# Altium schematic sheet 03-PulseGenerator.SchDoc
size A4
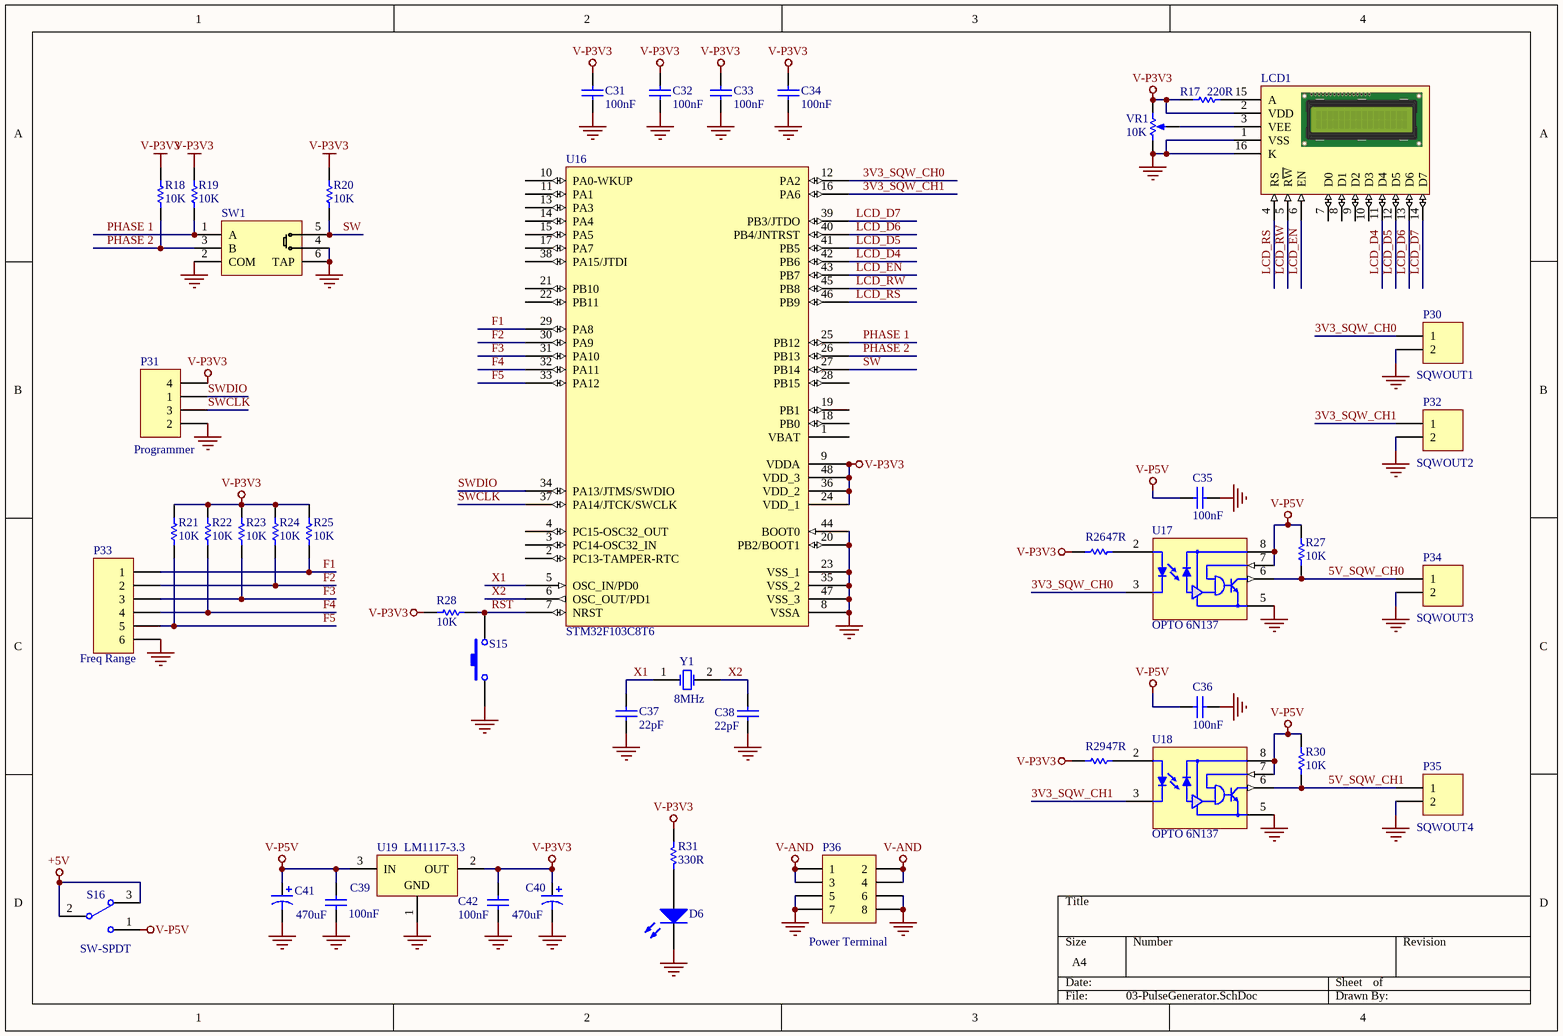
[diagram p0: 03-PulseGenerator.SchDoc]

## Parts
C31  value 100nF  [c-0805]  (hidden comment: 104)
C32  value 100nF  [c-0805]  (hidden comment: 104)
C33  value 100nF  [c-0805]  (hidden comment: 104)
C34  value 100nF  [c-0805]  (hidden comment: 104)
C35  value 100nF  [c-0805]  (hidden comment: 104)
C36  value 100nF  [c-0805]  (hidden comment: 104)
C37  value 22pF  [c-0805]  (hidden comment: 22)
C38  value 22pF  [c-0805]  (hidden comment: 22)
C39  value 100nF  [c-0805]  (hidden comment: 104)
C40  value 470uF  [C-ALU-10x10mm]  (hidden comment: 470uF/16V)
C41  value 470uF  [C-ALU-10x10mm]  (hidden comment: 470uF/16V)
C42  value 100nF  [c-0805]  (hidden comment: 104)
D6  LED  [LED-3528]  (value not drawn)
LCD1  LCD1602  [LCD-1602A]  (value not drawn)
P30  value SQWOUT1  [hed2]  (hidden comment: KF301)
P31  value Programmer  [HDR1X4]  (hidden comment: H4)
P32  value SQWOUT2  [hed2]  (hidden comment: KF301)
P33  value Freq Range  [HDR1X6]  (hidden comment: SW-5Way)
P34  value SQWOUT3  [hed2]  (hidden comment: KF301)
P35  value SQWOUT4  [hed2]  (hidden comment: KF301)
P36  Publisher: Power Terminal  [HDR2X4]  (hidden comment: Header 4X2)
R17  220R  [r-0805]
R18  value 10K  [r-0805]  (hidden comment: Res1)
R19  value 10K  [r-0805]  (hidden comment: Res1)
R20  value 10K  [r-0805]  (hidden comment: Res1)
R21  value 10K  [r-0805]  (hidden comment: Res1)
R22  value 10K  [r-0805]  (hidden comment: Res1)
R23  value 10K  [r-0805]  (hidden comment: Res1)
R24  value 10K  [r-0805]  (hidden comment: Res1)
R25  value 10K  [r-0805]  (hidden comment: Res1)
R26  47R  [r-0805]
R27  value 10K  [r-0805]  (hidden comment: Res1)
R28  value 10K  [r-0805]  (hidden comment: Res1)
R29  47R  [r-0805]
R30  value 10K  [r-0805]  (hidden comment: Res1)
R31  value 330R  [r-0805]  (hidden comment: 331)
S15  SW-S6  [sw2]  (value not drawn)
S16  SW-SPDT  [SW-DIP1SMD]
SW1  EC11  [SW-ENCODER]  (value not drawn)
U16  STM32F103C8T6  [LQFP-48]
U17  OPTO 6N137  [DIP8-300]
U18  OPTO 6N137  [DIP8-300]
U19  LM1117-3.3  [sot223]
VR1  10K  [VR1]
Y1  8MHz  [XTAL-RU49/4]

## Nets
+5V: S16.2 S16.3
GND: C31.1 C32.1 C33.1 C34.1 C35.1 C36.1 C37.1 C38.1 C39.1 C40.2 C41.2 C42.1 D6.2(K) LCD1.1(VSS) LCD1.16(K) P30.2 P31.2 P32.2 P33.6 P34.2 P35.2 P36.5 P36.6 P36.7 P36.8 S15.1 SW1.2(COM) SW1.4(BT+) SW1.6(TAP) U16.8(VSSA) U16.20(PB2/BOOT1) U16.23(VSS_1) U16.35(VSS_2) U16.44(BOOT0) U16.47(VSS_3) U17.5(GND) U18.5(GND) U19.1(GND) VR1.1(TOP)
V-AND: P36.1 P36.2 P36.3 P36.4
V-P3V3: C31.2 C32.2 C33.2 C34.2 C40.1 C42.2 LCD1.2(VDD) P31.4 R17.1 R18.2 R19.2 R20.2 R21.1 R22.1 R23.1 R24.1 R25.1 R26.1 R28.2 R29.1 R31.1 U16.9(VDDA) U16.24(VDD_1) U16.36(VDD_2) U16.48(VDD_3) U19.2(OUT) VR1.3(BOT)
V-P5V: C35.2 C36.2 C39.2 C41.1 R27.1 R30.1 S16.1 U17.7(EN) U17.8(VCC) U18.7(EN) U18.8(VCC) U19.3(IN)
3V3_SQW_CH0: P30.1 U16.12(PA2) U17.3(VF-)
3V3_SQW_CH1: P32.1 U16.16(PA6) U18.3(VF-)
5V_SQW_CH0: P34.1 R27.2 U17.6(Vo)
5V_SQW_CH1: P35.1 R30.2 U18.6(Vo)
F1: P33.1 R25.2 U16.29(PA8)
F2: P33.2 R24.2 U16.30(PA9)
F3: P33.3 R23.2 U16.31(PA10)
F4: P33.4 R22.2 U16.32(PA11)
F5: P33.5 R21.2 U16.33(PA12)
LCD_D4: LCD1.11(D4) U16.42(PB6)
LCD_D5: LCD1.12(D5) U16.41(PB5)
LCD_D6: LCD1.13(D6) U16.40(PB4/JNTRST)
LCD_D7: LCD1.14(D7) U16.39(PB3/JTDO)
LCD_EN: LCD1.6(EN) U16.43(PB7)
LCD_RS: LCD1.4(RS) U16.46(PB9)
LCD_RW: LCD1.5(R~{W}) U16.45(PB8)
PHASE 1: R19.1 SW1.1(A) U16.25(PB12)
PHASE 2: R18.1 SW1.3(B) U16.26(PB13)
RST: R28.1 S15.2 U16.7(NRST)
SW: R20.1 SW1.5(BT-) U16.27(PB14)
SWCLK: P31.3 U16.37(PA14/JTCK/SWCLK)
SWDIO: P31.1 U16.34(PA13/JTMS/SWDIO)
X1: C37.2 U16.5(OSC_IN/PD0) Y1.1(OSC1)
X2: C38.2 U16.6(OSC_OUT/PD1) Y1.2(OSC2)
NetD6_1: D6.1(A) R31.2
NetLCD1_3: LCD1.3(VEE) VR1.2(TAP)
NetLCD1_15: LCD1.15(A) R17.2
NetR26_2: R26.2 U17.2(VF+)
NetR29_2: R29.2 U18.2(VF+)

Not connected (* = marked no-connect by the designer): LCD1 7(D0) 8(D1) 9(D2) 10(D3); U16 1(VBAT) 2(PC13-TAMPER-RTC) 3(PC14-OSC32_IN) 4(PC15-OSC32_OUT) 10(PA0-WKUP) 11(PA1) 13(PA3) 14(PA4) 15(PA5) 17(PA7) 18(PB0) 19(PB1) 21(PB10) 22(PB11) 28(PB15) 38(PA15/JTDI); U17 1(NC) 4(NC); U18 1(NC) 4(NC)

## Library data of the parts
C31-C38 = Cap: Capacitor; Published: 8-Jun-2000; LatestRevisionDate: 17-Jul-2002; LatestRevisionNote: Re-released for DXP Platform.; PackageReference: RAD-0.3; Publisher: Altium Limited; PackageDescription: Radial Cap, Thru-Hole; 2 Leads; 0.3 in Pin Spacing
C39 C42 = Cap: Capacitor; Manufacturer: Generic Components; Class: Passive; Published: 08/06/2000; Publisher: Altium Hobart Technology Centre; SubClass: Capacitor
C40 C41 = Cap Pol1: Polarized Capacitor (Radial); Published: 8-Jun-2000; LatestRevisionDate: 17-Jul-2002; LatestRevisionNote: Re-released for DXP Platform.; PackageReference: RB7.6-15; Publisher: Altium Limited
D6 = LED0: Typical INFRARED GaAs LED; Published: 8-Jun-2000; LatestRevisionDate: 08-Jul-2005; LatestRevisionNote: Mech Layer 1 removed.; PackageReference: LED-0; Publisher: Altium Limited; Value: LED
LCD1 = LCD1602: Liquid Crystal Display; Value: LCD1602
P30 P32 P34 P35 = Header 2: Header, 2-Pin; LatestRevisionDate: 17-Jul-2002; LatestRevisionNote: Re-released for DXP Platform.
P31 = Header 4: Header, 4-Pin; LatestRevisionDate: 17-Jul-2002; LatestRevisionNote: Re-released for DXP Platform.
P33 = Header 6: Header, 6-Pin; LatestRevisionDate: 17-Jul-2002; LatestRevisionNote: Re-released for DXP Platform.
P36 = Header 4X2: Header, 4-Pin, Dual row; LatestRevisionDate: 17-Jul-2002; LatestRevisionNote: Re-released for DXP Platform.
R17-R31 = Res1: Resistor; Published: 8-Jun-2000; LatestRevisionDate: 17-Jul-2002; LatestRevisionNote: Re-released for DXP Platform.; PackageReference: AXIAL-0.3; Publisher: Altium Limited
  R17: PackageDescription: Axial Device, Thru-Hole; 2 Leads; 0.3 in Pin Spacing; Value: 220R
  R26 R29: Value: 47R
S15 = SW-PB: Switch; Value: Reset; Published: 24-Mar-1999; LatestRevisionDate: 17-Jul-2002; LatestRevisionNote: Re-released for DXP Platform.; PackageReference: SPST-2; PackageDescription: Switch; 2 Leads
S16 = SW-SPDT: SPDT Subminiature Toggle Switch, Right Angle Mounting, Vertical Actuation; Published: 24-Mar-1999; LatestRevisionDate: 17-Dec-2003; LatestRevisionNote: Schematic revised, PCB Footprint replaced.; DatasheetVersion: 05-Dec-2000; PackageReference: TL36WW15050; Publisher: Altium Limited; PackageDescription: Switch; 4 Leads; ComponentLink1Description: Manufacturer Link; ComponentLink1URL: http://www.apem.com
SW1 = SW EC11: Rotary Encoder with Switch; Value: EC11
U16 = STM32F103C8T6: STM32 ARM-based 32-bit MCU with 64 Kbytes Flash, 48-pin LQFP, Industrial Temperature; Published: 30-May-2008; DatasheetVersion: rev6, Mar-2008; PackageVersion: Mar-2008; PackageReference: LQFP48; Publisher: Altium Limited; PackageDescription: 48-Pin Low-Profile Quad Flat Pack, 7 x 7 mm Body, 0.5 mm Pitch (LQFP48); ComponentLink1Description: Manufacturer Link; ComponentLink1URL: www.st.com/stm32; ComponentLink2Description: Datasheet; ComponentLink2URL: http://www.st.com/stonline/products/literature/ds/13587.pdf
U17 U18 = OPTO 6N137: High Speed 10MBit/s Logic Gata Optocouplers; Value: 6N137
U19 = LM1117IDTX-3.3: 800mA Low-Dropout Linear Regulator, 3-pin TO-252; Manufacturer: National Semiconductor; PackageTopMarking: NSUZXYTT*LM1117*IDT-3.3; PowerWise: N; CompType: LDO IC; Published: 1-Mar-2010; DatasheetVersion: Apr-2006; PackageVersion: revD, Feb-2009; PackageReference: TD03B; Publisher: Altium Limited; PackageDescription: TO252, Molded, Jedec, 6.8 x 6.10 x 2.30mm Body, 3 Lead, 2.28mm Pitch, Surface Mount; PartNumber: LM1117IDTX-3.3; Value: LM1117-3.3; PinCount: 3; Code_JEDEC: TO-252-AA; ComponentLink1Description: LM1117 Datasheet; ComponentLink1URL: http://www.national.com/ds/LM/LM1117.pdf; ComponentLink2Description: LM1117 Web Page; ComponentLink2URL: http://www.national.com/pf/LM/LM1117.html; ComponentLink3Description: TD03B Package Page; ComponentLink3URL: http://www.national.com/packaging/folders/td03b.html
VR1 = RPot: Potentiometer; Sim Note: Enter the Resistance value and the set point into parameter fields.; Set Position: 0.5; Published: 8-Jun-2000; LatestRevisionDate: 17-Jul-2002; LatestRevisionNote: Re-released for DXP Platform.; PackageReference: VR5; Publisher: Altium Limited; PackageDescription: Variable Resistor, Thru-Hole; 3 Leads; Value: 10K
Y1 = XTAL: Crystal Oscillator; Published: 8-Jun-2000; LatestRevisionDate: 17-Jul-2002; LatestRevisionNote: Re-released for DXP Platform.; PackageReference: R38; Value: 8MHz; PackageDescription: Crystal, Thru-Hole; 2 Leads; Body 3.1 x 8.2 mm (Dia.xH)